# Altium schematic sheet input.SCHDOC
size B
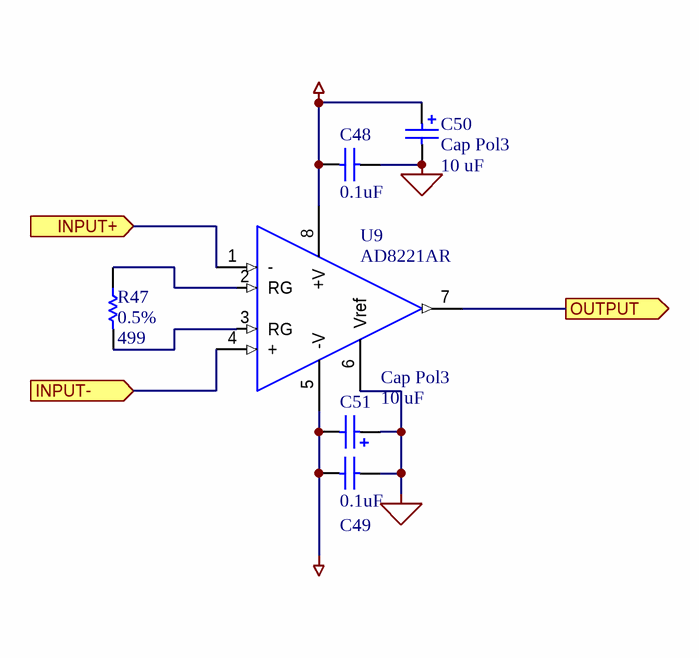
[diagram p0: input.SCHDOC]

## Parts
C48  value 0.1uF  [CC1608-0603]  (hidden comment: Cap)
C49  value 0.1uF  [CC1608-0603]  (hidden comment: Cap)
C50  Cap Pol3  value 10 uF  [TC3216-1206]
C51  Cap Pol3  value 10 uF  [TC3216-1206]
R47  0.5%  value 499  [R2012-0805]
U9  AD8221AR  [SO-G8]

## Ports
INPUT+ (in), INPUT- (in), OUTPUT (out)

## Nets
AVDD: C48.1 C50.1 U9.8(+V)
AVSS: C49.1 C51.2 U9.5(-V)
GND: C48.2 C49.2 C50.2 C51.1 U9.6(Vref)
INPUT+: U9.1(-) ; port INPUT+
INPUT-: U9.4(+) ; port INPUT-
OUTPUT: U9.7(Vout) ; port OUTPUT
NetR47_1: R47.1 U9.2(RG)
NetR47_2: R47.2 U9.3(RG)

## Library data of the parts
C48 C49 = Cap: Capacitor; Manufacturer: Generic Components; Class I: Passive; Published: 8-Jun-2000; Revision: July-2002: Re-released for DXP Platform.; Publisher: Altium Limited; Class II: Capacitor
C50 C51 = Cap Pol3: Polarized Capacitor (Surface Mount); Manufacturer: Generic Components; Class I: Passive; Published: 8-Jun-2000; Revision: July-2002: Re-released for DXP Platform.; Publisher: Altium Limited; Class II: Capacitor
R47 = Res1: RR1220P-4990-D-M; Manufacturer: Generic Components; Class I: Passive; Class II: Resistor; Published: 8-Jun-2000; Revision: July-2002: Re-released for DXP Platform.; Publisher: Altium Limited
U9 = AD8221: AD8221 Precision Instrumentation Amplifier